# Altium schematic sheet Measurements.SchDoc: Measurement circuits
size A3; Author: Kajetan Śpionek
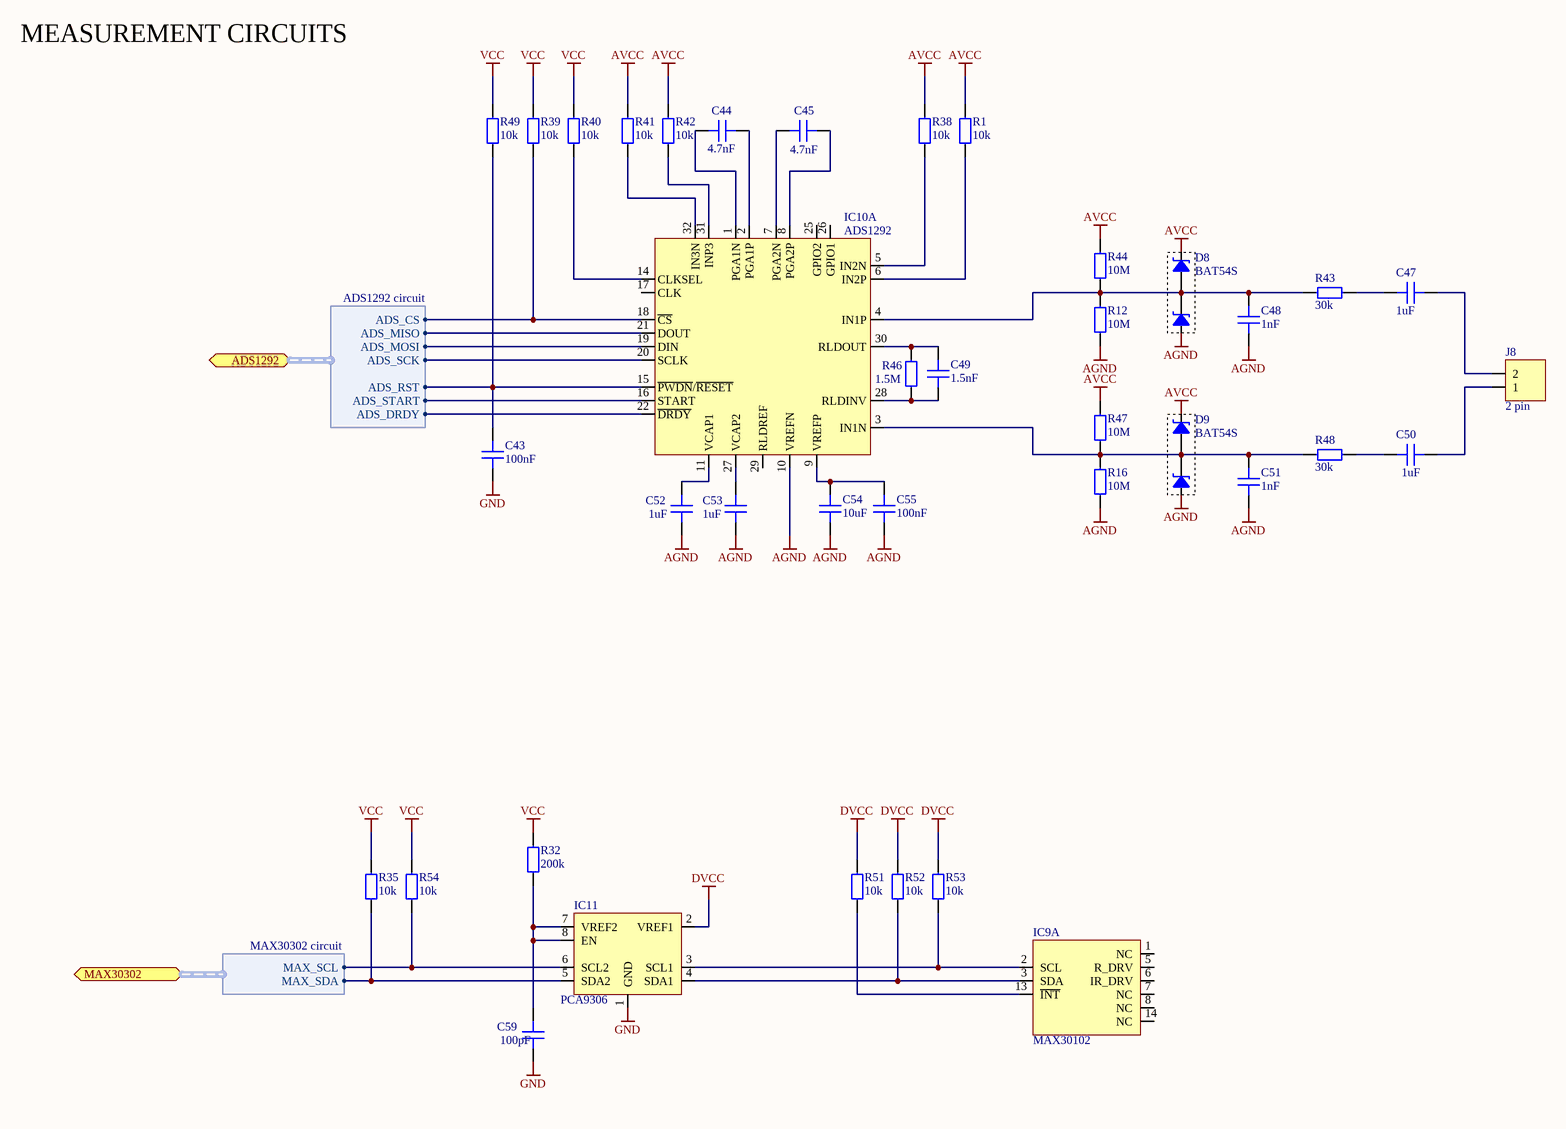
[diagram p0: Measurements.SchDoc]

## Parts
C43  100nF  [CAP 0603]
C44  4.7nF  [CAP 0603]
C45  4.7nF  [CAP 0603]
C47  1uF  [CAP 0603]
C48  1nF  [CAP 0603]
C49  1.5nF  [CAP 0603]
C50  1uF  [CAP 0603]
C51  1nF  [CAP 0603]
C52  1uF  [CAP 0603]
C53  1uF  [CAP 0603]
C54  10uF  [CAP 0603]
C55  100nF  [CAP 0603]
C59  100pF  [CAP 0603]
D8  BAT54S  [SOT23]
D9  BAT54S  [SOT23]
IC9  MAX30102  [MAX30102]  (part A of 2)
IC10  ADS1292  [TQFP40]  (part A of 2)
IC11  PCA9306  [SSOP8]
J8  2 pin  [HDR 1x2 2.54]
R1  10k  [RES 0603]
R12  10M  [RES 0603]
R16  10M  [RES 0603]
R32  200k  [RES 0603]
R35  10k  [RES 0603]
R38  10k  [RES 0603]
R39  10k  [RES 0603]
R40  10k  [RES 0603]
R41  10k  [RES 0603]
R42  10k  [RES 0603]
R43  30k  [RES 0603]
R44  10M  [RES 0603]
R46  1.5M  [RES 0603]
R47  10M  [RES 0603]
R48  30k  [RES 0603]
R49  10k  [RES 0603]
R51  10k  [RES 0603]
R52  10k  [RES 0603]
R53  10k  [RES 0603]
R54  10k  [RES 0603]

## Ports
ADS1292 (harness ADS1292 circuit), MAX30302 (harness MAX30302 circuit)

## Harnesses
ADS1292 circuit: ADS_RST, ADS_DRDY, ADS_CS, ADS_START, ADS_SCK, ADS_MISO, ADS_MOSI
MAX30302 circuit: MAX_SCL, MAX_SDA

## Nets
AGND: C48.1 C51.1 C52.1 C53.1 C54.1 C55.1 D8.1 D9.1 IC10.10(VREFN) R12.2 R16.2
AVCC: D8.2 D9.2 R1.1 R38.1 R41.2 R42.2 R44.1 R47.1
DVCC: IC11.2(VREF1) R51.2 R52.2 R53.2
GND: C43.1 C59.1 IC11.1(GND)
VCC: R32.2 R35.2 R39.2 R40.2 R49.2 R54.2
NetC43_2: C43.2 IC10.15(~{PWDN}/~{RESET}) R49.1 ; port ADS1292.ADS_RST
NetC44_1: C44.1 IC10.1(PGA1N)
NetC44_2: C44.2 IC10.2(PGA1P)
NetC45_1: C45.1 IC10.7(PGA2N)
NetC45_2: C45.2 IC10.8(PGA2P)
NetC47_1: C47.1 J8.2
NetC47_2: C47.2 R43.1
NetC48_2: C48.2 D8.3 IC10.4(IN1P) R12.1 R43.2 R44.2
NetC49_1: C49.1 IC10.28(RLDINV) R46.1
NetC49_2: C49.2 IC10.30(RLDOUT) R46.2
NetC50_1: C50.1 J8.1
NetC50_2: C50.2 R48.1
NetC51_2: C51.2 D9.3 IC10.3(IN1N) R16.1 R47.2 R48.2
NetC52_2: C52.2 IC10.11(VCAP1)
NetC53_2: C53.2 IC10.27(VCAP2)
NetC54_2: C54.2 C55.2 IC10.9(VREFP)
NetC59_2: C59.2 IC11.7(VREF2) IC11.8(EN) R32.1
NetIC9_2: IC9.2(SCL) IC11.3(SCL1) R53.1
NetIC9_3: IC9.3(SDA) IC11.4(SDA1) R52.1
NetIC9_13: IC9.13(~{INT}) R51.1
NetIC10_5: IC10.5(IN2N) R38.2
NetIC10_6: IC10.6(IN2P) R1.2
NetIC10_14: IC10.14(CLKSEL) R40.1
NetIC10_16: IC10.16(START) ; port ADS1292.ADS_START
NetIC10_18: IC10.18(~{CS}) R39.1 ; port ADS1292.ADS_CS
NetIC10_19: IC10.19(DIN) ; port ADS1292.ADS_MOSI
NetIC10_20: IC10.20(SCLK) ; port ADS1292.ADS_SCK
NetIC10_21: IC10.21(DOUT) ; port ADS1292.ADS_MISO
NetIC10_22: IC10.22(~{DRDY}) ; port ADS1292.ADS_DRDY
NetIC10_31: IC10.31(INP3) R42.1
NetIC10_32: IC10.32(IN3N) R41.1
NetIC11_5: IC11.5(SDA2) R35.1 ; port MAX30302.MAX_SDA
NetIC11_6: IC11.6(SCL2) R54.1 ; port MAX30302.MAX_SCL

Not connected (* = marked no-connect by the designer): IC9 1(NC) 5(R_DRV) 6(IR_DRV) 7(NC) 8(NC) 14(NC); IC10 17(CLK) 25(GPIO2) 26(GPIO1) 29(RLDREF)

## Notes on the sheet
- MEASUREMENT CIRCUITS

## Library data of the parts
C43-C45 C47-C55 C59 = Capacitor: SMT Capacitor
  C43 C55: Value: 100nF
  C44 C45: Value: 4.7nF
  C47 C50 C52 C53: Value: 1uF
  C48 C51: Value: 1nF
  C49: Value: 1.5nF
  C54: Value: 10uF
  C59: Value: 100pF
D8 D9 = BAT54S: Schottky barrier diodes; Value: BAT54S
IC9 = MAX30102: Pulse Oximeter and Heart-Rate Sensor
IC10 = ADS1292IRSMT: ADS1292IRSMT Analog Front End - AFE Cmplt Lw Pwr Intgrtd AFE for ECG apps; Manufacture: Texas Instruments; SNR - Signal to Noise Ratio: 107 dB; Package/Cas: VQFN-32; Supply Voltage - Min - Max: 2.7V - 5.25V; Operating Supply Curren: 750 uA; Operating Supply Voltage: 1.7 V to 3.6 V, 2.7 V to 5.25 V; Product Category: Analog Front End - AFE; Series: ADS1292; DatasheetURL: http://www.ti.com/lit/ds/symlink/ads1292.pdf; StoreURL: http://pl.mouser.com/Search/ProductDetail.aspx?R=ADS1292IRSMTvirtualkey59500000virtualkey595-ADS1292IRSMT
IC11 = PCA9306: Dual Bidirectional I2C Bus and SMBus Voltage-Level Translator
J8 = 2 Pin: 2 pin header, male
R1 R12 R16 R32 R35 R38-R44 R46-R49 R51-R54 = Resistor: SMDResistor
  R1 R35 R38-R42 R49 R51-R54: Value: 10k
  R12 R16 R44 R47: Value: 10M
  R32: Value: 200k
  R43 R48: Value: 30k
  R46: Value: 1.5M